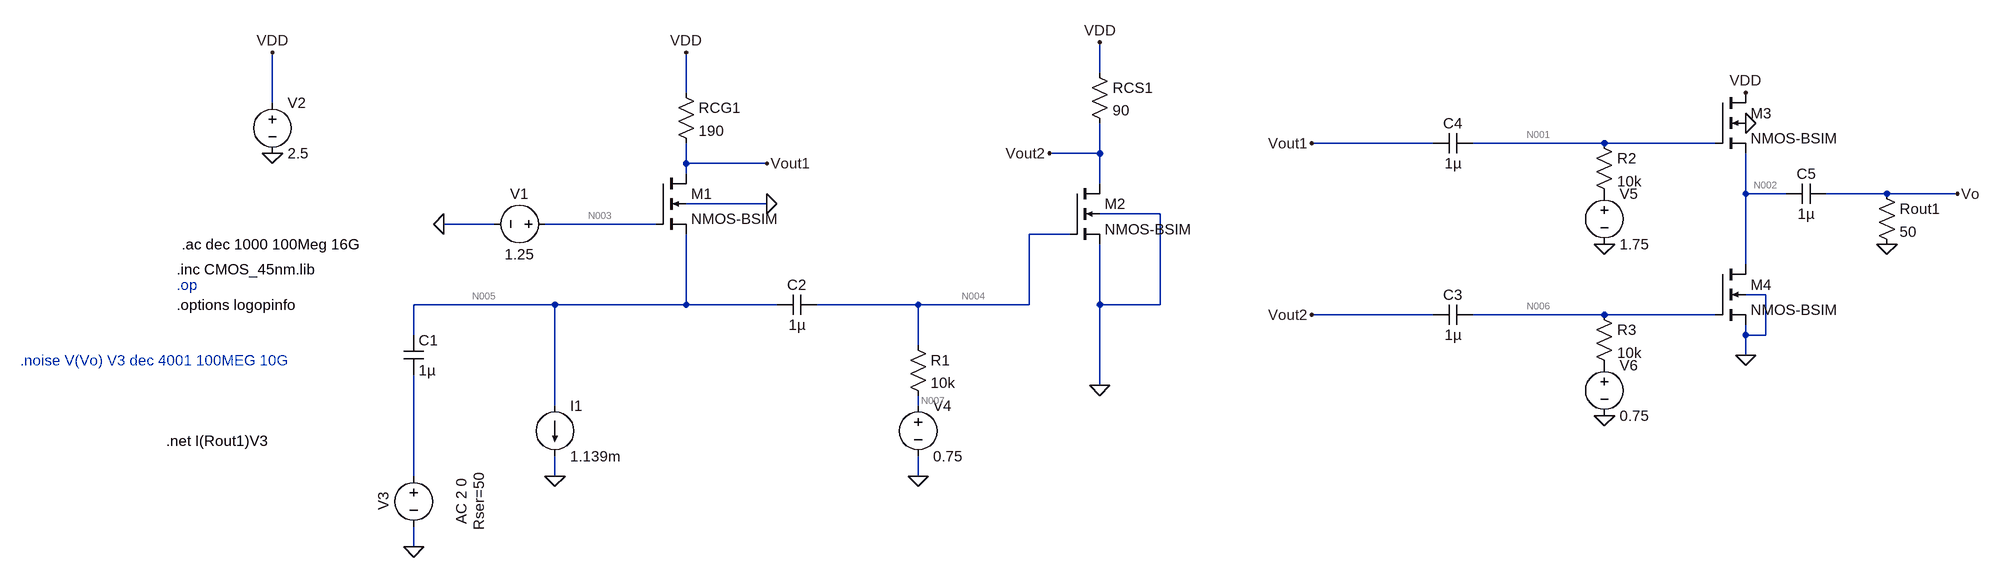
[diagram p0: schematic NMOS_45nm.asc]
NMOS_45nm.asc, the LTspice schematic file:
Version 4.1
SHEET 1 2016 680
WIRE 608 -224 608 -272
WIRE -48 -192 -48 -256
WIRE -704 -176 -704 -256
WIRE 1136 -112 944 -112
WIRE 1408 -112 1200 -112
WIRE 1584 -112 1408 -112
WIRE 608 -96 608 -144
WIRE 608 -96 528 -96
WIRE -48 -80 -48 -112
WIRE 80 -80 -48 -80
WIRE -48 -64 -48 -80
WIRE 608 -48 608 -96
WIRE 1632 -32 1632 -96
WIRE 1696 -32 1632 -32
WIRE 1856 -32 1760 -32
WIRE 1968 -32 1856 -32
WIRE 80 -16 -48 -16
WIRE 704 0 608 0
WIRE -352 16 -432 16
WIRE -96 16 -272 16
WIRE 560 32 496 32
WIRE 1632 80 1632 -32
WIRE 1664 128 1632 128
WIRE -256 144 -480 144
WIRE -48 144 -48 32
WIRE -48 144 -256 144
WIRE 96 144 -48 144
WIRE 320 144 160 144
WIRE 496 144 496 32
WIRE 496 144 320 144
WIRE 608 144 608 48
WIRE 704 144 704 0
WIRE 704 144 608 144
WIRE 1136 160 944 160
WIRE 1408 160 1200 160
WIRE 1584 160 1408 160
WIRE -480 192 -480 144
WIRE 1632 192 1632 176
WIRE 1664 192 1664 128
WIRE 1664 192 1632 192
WIRE 320 208 320 144
WIRE 1632 224 1632 192
WIRE 608 272 608 144
WIRE -256 304 -256 144
WIRE 320 304 320 288
WIRE -480 416 -480 256
WIRE -256 416 -256 384
WIRE 320 416 320 384
WIRE -480 528 -480 496
FLAG -432 16 0
FLAG -704 -96 0
FLAG -704 -256 VDD
FLAG -48 -256 VDD
FLAG -256 416 0
FLAG 80 -16 0
FLAG -480 528 0
FLAG 80 -80 Vout1
FLAG 528 -96 Vout2
FLAG 608 272 0
FLAG 608 -272 VDD
FLAG 320 416 0
FLAG 1408 48 0
FLAG 1408 320 0
FLAG 1632 224 0
FLAG 1632 -192 VDD
FLAG 944 160 Vout2
FLAG 944 -112 Vout1
FLAG 1632 -144 0
FLAG 1968 -32 Vo
FLAG 1856 48 0
SYMBOL voltage -256 16 R90
WINDOW 0 -32 56 VBottom 2
WINDOW 3 32 56 VTop 2
WINDOW 123 0 0 Left 0
WINDOW 39 0 0 Left 0
SYMATTR InstName V1
SYMATTR Value 1.25
SYMBOL voltage -704 -192 R0
SYMATTR InstName V2
SYMATTR Value 2.5
SYMBOL res -64 -208 R0
SYMATTR InstName RCG1
SYMATTR Value 190
SYMBOL voltage -480 400 R0
WINDOW 0 -32 56 VBottom 2
WINDOW 3 32 56 VTop 2
WINDOW 123 60 56 VTop 2
WINDOW 39 88 56 VTop 2
SYMATTR InstName V3
SYMATTR Value ""
SYMATTR Value2 AC 2 0
SYMATTR SpiceLine Rser=50
SYMBOL nmos4 -96 -64 R0
SYMATTR InstName M1
SYMATTR Value NMOS-BSIM
SYMATTR Value2 l=90n w=45u
SYMBOL current -256 304 R0
WINDOW 123 0 0 Left 0
WINDOW 39 0 0 Left 0
SYMATTR InstName I1
SYMATTR Value 1.139m
SYMBOL cap -496 192 R0
SYMATTR InstName C1
SYMATTR Value 1µ
SYMBOL nmos4 560 -48 R0
SYMATTR InstName M2
SYMATTR Value NMOS-BSIM
SYMATTR Value2 l=90n w=45u
SYMBOL res 592 -240 R0
SYMATTR InstName RCS1
SYMATTR Value 90
SYMBOL cap 160 128 R90
WINDOW 0 0 32 VBottom 2
WINDOW 3 32 32 VTop 2
SYMATTR InstName C2
SYMATTR Value 1µ
SYMBOL voltage 320 288 R0
SYMATTR InstName V4
SYMATTR Value 0.75
SYMBOL res 304 192 R0
SYMATTR InstName R1
SYMATTR Value 10k
SYMBOL cap 1200 144 R90
WINDOW 0 0 32 VBottom 2
WINDOW 3 32 32 VTop 2
SYMATTR InstName C3
SYMATTR Value 1µ
SYMBOL cap 1200 -128 R90
WINDOW 0 0 32 VBottom 2
WINDOW 3 32 32 VTop 2
SYMATTR InstName C4
SYMATTR Value 1µ
SYMBOL res 1392 -128 R0
SYMATTR InstName R2
SYMATTR Value 10k
SYMBOL res 1392 144 R0
SYMATTR InstName R3
SYMATTR Value 10k
SYMBOL voltage 1408 -48 R0
WINDOW 123 0 0 Left 0
WINDOW 39 0 0 Left 0
SYMATTR InstName V5
SYMATTR Value 1.75
SYMBOL voltage 1408 224 R0
SYMATTR InstName V6
SYMATTR Value 0.75
SYMBOL nmos4 1584 -192 R0
SYMATTR InstName M3
SYMATTR Value NMOS-BSIM
SYMATTR Value2 l=90n w=45u
SYMBOL nmos4 1584 80 R0
SYMATTR InstName M4
SYMATTR Value NMOS-BSIM
SYMATTR Value2 l=90n w=45u
SYMBOL cap 1760 -48 R90
WINDOW 0 0 32 VBottom 2
WINDOW 3 32 32 VTop 2
SYMATTR InstName C5
SYMATTR Value 1µ
SYMBOL res 1840 -48 R0
SYMATTR InstName Rout1
SYMATTR Value 50
TEXT -856 112 Left 2 ;.op
TEXT -856 144 Left 2 !.options logopinfo
TEXT -856 88 Left 2 !.inc CMOS_45nm.lib
TEXT -848 48 Left 2 !.ac dec 1000 100Meg 16G
TEXT -1104 232 Left 2 ;.noise V(Vo) V3 dec 4001 100MEG 10G
TEXT -872 360 Left 2 !.net I(Rout1)V3

The netlist it stands for:
* NMOS_45nm.asc
V1 N003 0 1.25
V2 VDD 0 2.5
RCG1 VDD Vout1 190
V3 N008 0 AC 2 0 Rser=50
M1 Vout1 N003 N005 0 NMOS-BSIM l=90n w=45u
I1 N005 0 1.139m
C1 N005 N008 1µ
M2 Vout2 N004 0 0 NMOS-BSIM l=90n w=45u
RCS1 VDD Vout2 90
C2 N004 N005 1µ
V4 N007 0 0.75
R1 N004 N007 10k
C3 N006 Vout2 1µ
C4 N001 Vout1 1µ
R2 N001 P001 10k
R3 N006 P002 10k
V5 P001 0 1.75
V6 P002 0 0.75
M3 VDD N001 N002 0 NMOS-BSIM l=90n w=45u
M4 N002 N006 0 0 NMOS-BSIM l=90n w=45u
C5 Vo N002 1µ
Rout1 Vo 0 50
.model NMOS NMOS
.model PMOS PMOS
.lib standard.mos
* .op
.options logopinfo
.inc CMOS_45nm.lib
.ac dec 1000 100Meg 16G
* .noise V(Vo) V3 dec 4001 100MEG 10G
.net I(Rout1)V3
.backanno
.end

* Results of the author's LTspice run, read from the files saved beside the schematic
* Operating Point, zero values left out:
*   V(n001) = 1.739 V
*   V(n002) = 785.6 mV
*   V(n003) = 1.25 V
*   V(n004) = 747.7 mV
*   V(n005) = 602.1 mV
*   V(n006) = 747.5 mV
*   V(n007) = 750 mV
*   V(p001) = 1.75 V
*   V(p002) = 750 mV
*   V(vdd) = 2.5 V
*   V(vout1) = 2.281 V
*   V(vout2) = 1.47 V
*   I(I1) = 1.139 mA
*   I(R1) = -226.5 nA
*   I(R2) = -1.051 µA
*   I(R3) = -252.5 nA
*   I(RCG1) = 1.153 mA
*   I(RCS1) = 11.45 mA
*   I(V1) = 76.59 nA
*   I(V2) = -23.14 mA
*   I(V4) = -226.5 nA
*   I(V5) = -1.051 µA
*   I(V6) = -252.5 nA
*   Ib(M1) = -13.73 µA
*   Ib(M2) = -659.9 nA
*   Ib(M3) = -28.32 µA
*   Ib(M4) = -15.17 pA
*   Id(M1) = 1.153 mA
*   Id(M2) = 11.45 mA
*   Id(M3) = 10.54 mA
*   Id(M4) = 10.51 mA
*   Ig(M1) = -76.59 nA
*   Ig(M2) = 226.5 nA
*   Ig(M3) = 1.051 µA
*   Ig(M4) = 252.5 nA
*   Is(M1) = -1.139 mA
*   Is(M2) = -11.45 mA
*   Is(M3) = -10.51 mA
*   Is(M4) = -10.51 mA
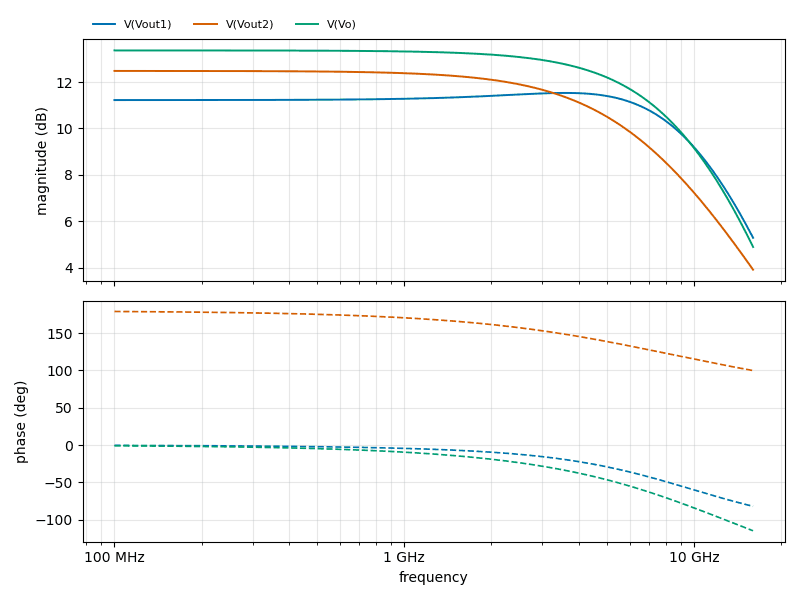
[diagram p1: AC Analysis of NMOS_45nm.asc, plotted from the saved traces]
* AC Analysis, 1 run:
*   V(Vout1): 11.22 dB at 100 MHz, 5.29 dB at 16 GHz, peak 11.53 dB at 3.589 GHz, 3 dB below the peak at 11.08 GHz
*   V(Vout2): 12.48 dB at 100 MHz, 3.91 dB at 16 GHz, peak 12.48 dB at 100 MHz, 3 dB below the peak at 6.588 GHz
*   V(Vo): 13.36 dB at 100 MHz, 4.89 dB at 16 GHz, peak 13.36 dB at 100 MHz, 3 dB below the peak at 8.25 GHz
* From the log:
*   Semiconductor Device Operating Points:
*                           --- BSIM4 MOSFETS ---
*   Name:       M1          M2          M3          M4
*   Model:  nmos-bsim   nmos-bsim   nmos-bsim   nmos-bsim
*   Id:      1.15e-03    1.14e-02    1.05e-02    1.05e-02
*   Vgs:     6.48e-01    7.48e-01    9.54e-01    7.47e-01
*   Vds:     1.68e+00    1.47e+00    1.71e+00    7.86e-01
*   Vbs:    -6.02e-01    0.00e+00   -7.86e-01    0.00e+00
*   Vth:     6.05e-01    4.55e-01    6.45e-01    4.63e-01
*   Vdsat:   8.68e-02    2.20e-01    2.36e-01    2.15e-01
*   Gm:      1.66e-02    5.39e-02    4.82e-02    5.15e-02
*   Gds:     3.89e-04    1.63e-03    1.90e-03    1.29e-03
*   Gmb      4.14e-03    1.81e-02    1.28e-02    1.72e-02
*   Cbd:     1.52e-14    1.67e-14    1.49e-14    1.86e-14
*   Cbs:     3.08e-14    3.60e-14    2.97e-14    3.60e-14